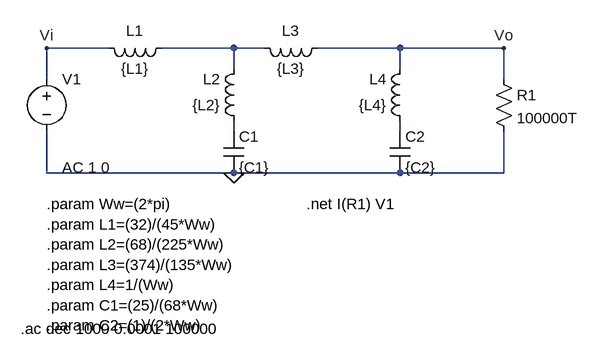
[diagram p0: schematic Ej2.asc]
Ej2.asc, the LTspice schematic file:
Version 4
SHEET 1 928 680
WIRE 160 80 64 80
WIRE 352 80 240 80
WIRE 400 80 352 80
WIRE 608 80 480 80
WIRE 768 80 608 80
WIRE 352 112 352 80
WIRE 608 112 608 80
WIRE 64 128 64 80
WIRE 768 128 768 80
WIRE 352 208 352 192
WIRE 608 208 608 192
WIRE 64 272 64 208
WIRE 352 272 64 272
WIRE 608 272 352 272
WIRE 768 272 768 208
WIRE 768 272 608 272
FLAG 352 272 0
FLAG 768 80 Vo
FLAG 64 80 Vi
SYMBOL ind 256 64 R90
WINDOW 0 5 56 VBottom 2
WINDOW 3 32 56 VTop 2
SYMATTR InstName L1
SYMATTR Value {L1}
SYMATTR SpiceLine Rser=0
SYMBOL ind 368 208 R180
WINDOW 0 36 80 Left 2
WINDOW 3 36 40 Left 2
SYMATTR InstName L2
SYMATTR Value {L2}
SYMATTR SpiceLine Rser=0
SYMBOL cap 336 208 R0
SYMATTR InstName C1
SYMATTR Value {C1}
SYMBOL ind 496 64 R90
WINDOW 0 5 56 VBottom 2
WINDOW 3 32 56 VTop 2
SYMATTR InstName L3
SYMATTR Value {L3}
SYMATTR SpiceLine Rser=0
SYMBOL ind 624 208 R180
WINDOW 0 36 80 Left 2
WINDOW 3 36 40 Left 2
SYMATTR InstName L4
SYMATTR Value {L4}
SYMATTR SpiceLine Rser=0
SYMBOL cap 592 208 R0
SYMATTR InstName C2
SYMATTR Value {C2}
SYMBOL voltage 64 112 R0
WINDOW 123 24 152 Left 2
WINDOW 39 24 124 Left 2
SYMATTR Value2 AC 1 0
SYMATTR InstName V1
SYMATTR Value ""
SYMBOL res 752 112 R0
SYMATTR InstName R1
SYMATTR Value 100000T
TEXT 64 320 Left 2 !.param Ww=(2*pi)\n.param L1=(32)/(45*Ww)\n.param L2=(68)/(225*Ww)\n.param L3=(374)/(135*Ww)\n.param L4=1/(Ww)\n.param C1=(25)/(68*Ww) \n.param C2=(1)/(2*Ww)
TEXT 464 320 Left 2 !.net I(R1) V1
TEXT 24 512 Left 2 !.ac dec 1000 0.0001 100000

The netlist it stands for:
* Ej2.asc
L1 N001 Vi {L1} Rser=0
L2 N002 N001 {L2} Rser=0
C1 N002 0 {C1}
L3 Vo N001 {L3} Rser=0
L4 N003 Vo {L4} Rser=0
C2 N003 0 {C2}
V1 Vi 0 AC 1 0
R1 Vo 0 100000T
.param Ww=(2*pi)
.param L1=(32)/(45*Ww)
.param L2=(68)/(225*Ww)
.param L3=(374)/(135*Ww)
.param L4=1/(Ww)
.param C1=(25)/(68*Ww)
.param C2=(1)/(2*Ww)
.net I(R1) V1
.ac dec 1000 0.0001 100000
.backanno
.end